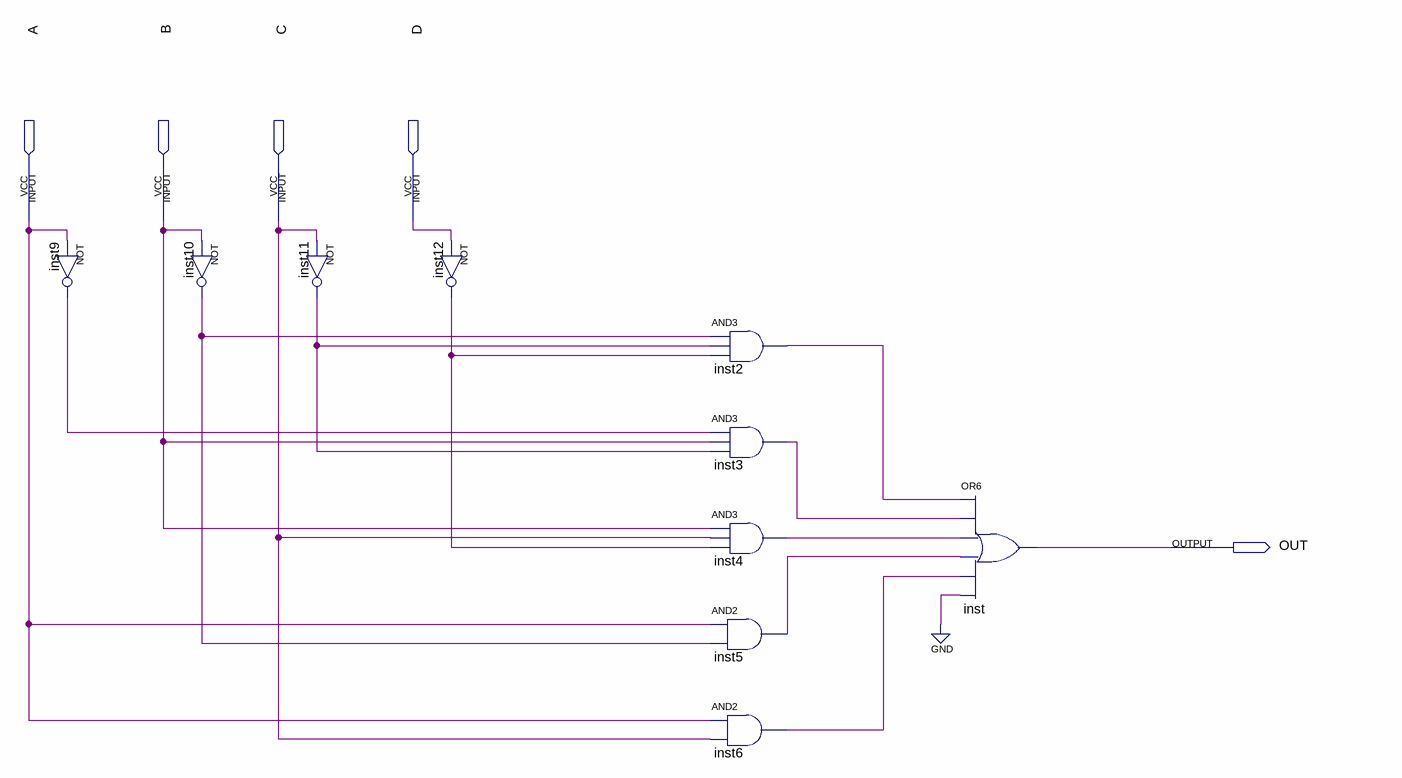
[diagram p0: schematic sheet]
// Quartus schematic ledF.bdf as structural Verilog: 10 symbols, 5 pins
module ledF (
  input  A,
  input  B,
  input  C,
  input  D,
  output OUT
);

  wire inst2_out, inst3_out, inst4_out, inst5_out, inst6_out, inst9_out, inst10_out, inst11_out, inst12_out;

  not inst9 (inst9_out, A);
  not inst10 (inst10_out, B);
  not inst11 (inst11_out, C);
  not inst12 (inst12_out, D);
  and inst2 (inst2_out, inst10_out, inst11_out, inst12_out);
  and inst3 (inst3_out, inst9_out, B, inst11_out);
  and inst4 (inst4_out, B, C, inst12_out);
  and inst5 (inst5_out, A, inst10_out);
  and inst6 (inst6_out, A, C);
  or inst (OUT, inst2_out, inst3_out, inst4_out, inst5_out, inst6_out, 1'b0);
endmodule
